# Altium schematic sheet Valve_SCH.SchDoc
size A
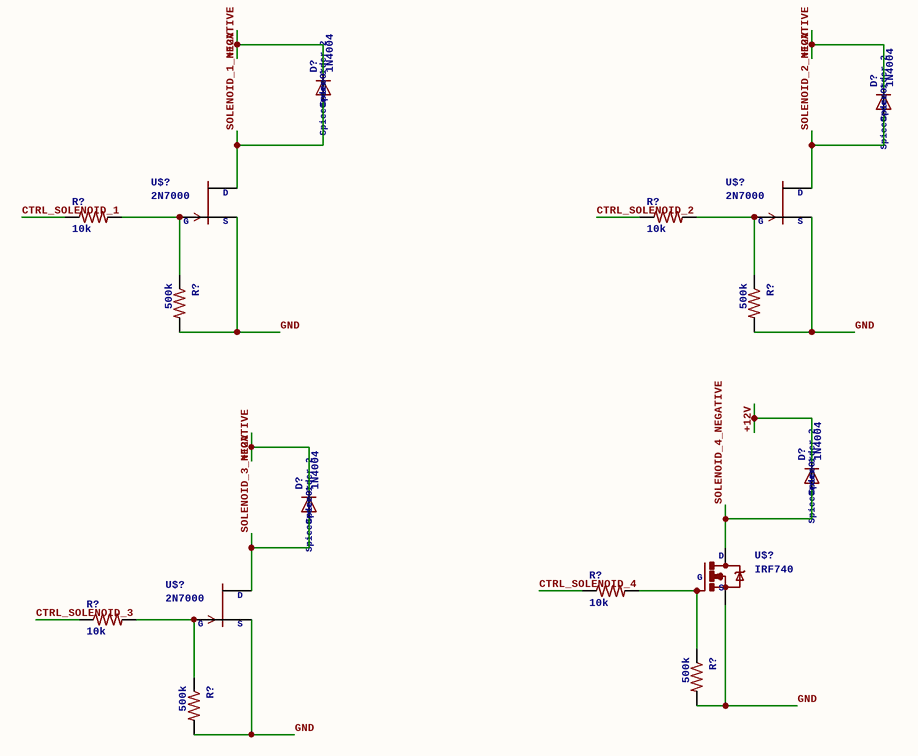
[diagram p0: Valve_SCH.SchDoc]

## Parts
(Parts that share a designator on the sheet are numbered #1, #2 ... from top to bottom, then left to right.)
D?#1  1N4004  SpiceOrder1: SpiceOrder 1  SpiceOrder2: SpiceOrder 2  [DO41-10]
D?#2  1N4004  SpiceOrder1: SpiceOrder 1  SpiceOrder2: SpiceOrder 2  [DO41-10]
D?#3  1N4004  SpiceOrder1: SpiceOrder 1  SpiceOrder2: SpiceOrder 2  [DO41-10]
D?#4  1N4004  SpiceOrder1: SpiceOrder 1  SpiceOrder2: SpiceOrder 2  [DO41-10]
R?#1  10k  [R0805]
R?#2  10k  [R0805]
R?#3  500k  [R0805]
R?#4  500k  [R0805]
R?#5  10k  [R0805]
R?#6  10k  [R0805]
R?#7  500k  [R0805]
R?#8  500k  [R0805]
U$?#1  2N7000  [SOT23]
U$?#2  2N7000  [SOT23]
U$?#3  IRF740  [TO220BV]
U$?#4  2N7000  [SOT23]

## Nets
+12V: D?#1.C D?#2.C D?#3.C D?#4.C
CTRL_SOLENOID_1: R?#1.1
CTRL_SOLENOID_2: R?#2.1
CTRL_SOLENOID_3: R?#6.1
CTRL_SOLENOID_4: R?#5.1
GND: R?#3.2 R?#4.2 R?#7.2 R?#8.2 U$?#1.2(S) U$?#2.2(S) U$?#3.S U$?#4.2(S)
SOLENOID_1_NEGATIVE: D?#1.A U$?#1.3(D)
SOLENOID_2_NEGATIVE: D?#2.A U$?#2.3(D)
SOLENOID_3_NEGATIVE: D?#4.A U$?#4.3(D)
SOLENOID_4_NEGATIVE: D?#3.A U$?#3.D
NetR?#1_2: R?#1.2 R?#3.1 U$?#1.1(G)
NetR?#2_2: R?#2.2 R?#4.1 U$?#2.1(G)
NetR?#5_2: R?#5.2 R?#7.1 U$?#3.G
NetR?#6_2: R?#6.2 R?#8.1 U$?#4.1(G)

## Library data of the parts
D?#1-D?#4 = 1N4004: DIODEgeneral purpose rectifier, 1 A; GateName_1: 1; SymbolName_1: D; LibraryName: diode; DeviceSetName: 1N4004
R?#1-R?#8 = R-US_R0805: RESISTOR, American symbol; GateName_1: G$1; SymbolName_1: R-US; DeviceSetName: R-US_; DeviceName: R0805; LibraryName: rcl
U$?#1 U$?#2 U$?#4 = 2N7000: GateName_1: G$1; SymbolName_1: JFET-N; LibraryName: transistor-fet-extra; DeviceSetName: 2N7000; D: D; S: S; G: G
U$?#3 = IRF740: N-CHANNEL MOS FET; GateName_1: G$1; SymbolName_1: MFNS; LibraryName: transistor-power; DeviceSetName: IRF740; D: D; S: S; G: G